# Altium schematic sheet CONNECTOR_BUS.SchDoc
size 420 x 297 mm; SheetNumber: 8; SheetTotal: 34
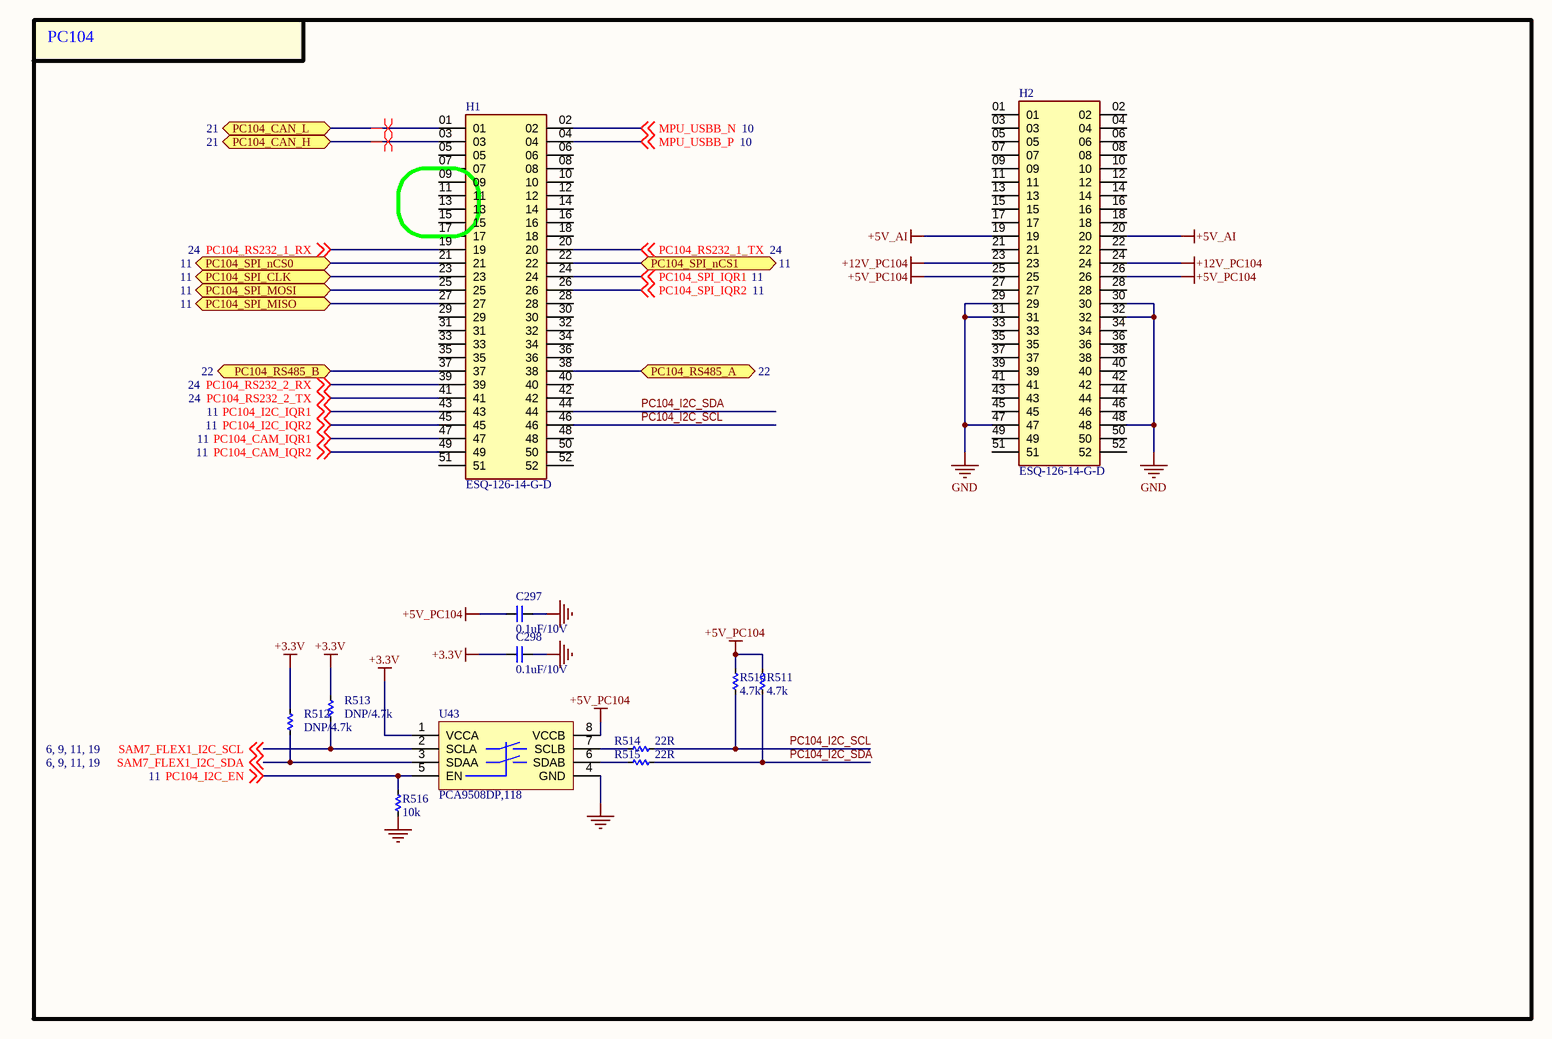
[diagram p0: CONNECTOR_BUS.SchDoc]

## Parts
C297  0.1uF/10V  [CAP_C_1005X50_L]
C298  0.1uF/10V  [CAP_C_1005X50_L]
H1  ESQ-126-14-G-D  [SAMTEC_ESQ-126-14-G-D]
H2  ESQ-126-14-G-D  [SAMTEC_ESQ-126-14-G-D]
R510  4.7k  [RES_C_1005X40]
R511  4.7k  [RES_C_1005X40]
R512  DNP/4.7k  [RES_C_1005X40]
R513  DNP/4.7k  [RES_C_1005X40]
R514  22R  [RES_C_1005X40]
R515  22R  [RES_C_1005X40]
R516  10k  [RES_C_1005X40]
U43  PCA9508DP,118  [TSOP8]

## Blocks framed on the sheet
PC104: C297 C298 H1 H2 R510-R516 U43

## Ports
PC104_CAN_H (bidir, see 21), PC104_CAN_L (bidir, see 21), PC104_RS485_A (bidir, see 22), PC104_RS485_B (bidir, see 22), PC104_SPI_CLK (bidir, see 11), PC104_SPI_MISO (bidir, see 11), PC104_SPI_MOSI (bidir, see 11), PC104_SPI_nCS0 (bidir, see 11), PC104_SPI_nCS1 (bidir, see 11)

## Nets
+3.3V: C298.2 R512.1 R513.1 U43.1(VCCA)
+5V_AI: H2.19 H2.20
+5V_PC104: C297.2 H2.25 H2.26 R510.1 R511.1 U43.8(VCCB)
+12V_PC104: H2.23 H2.24
GND: C297.1 C298.1 H2.29 H2.30 H2.31 H2.32 H2.47 H2.48 R516.2 U43.4(GND)
MPU_USBB_N: H1.02 ; off-sheet MPU_USBB_N
MPU_USBB_P: H1.04 ; off-sheet MPU_USBB_P
PC104_CAM_IQR1: H1.47 ; off-sheet PC104_CAM_IQR1
PC104_CAM_IQR2: H1.49 ; off-sheet PC104_CAM_IQR2
PC104_CAN_H: H1.03 ; port PC104_CAN_H
PC104_CAN_L: H1.01 ; port PC104_CAN_L
PC104_I2C_EN: R516.1 U43.5(EN) ; off-sheet PC104_I2C_EN
PC104_I2C_IQR1: H1.43 ; off-sheet PC104_I2C_IQR1
PC104_I2C_IQR2: H1.45 ; off-sheet PC104_I2C_IQR2
PC104_I2C_SCL: H1.46 R510.2 R514.2
PC104_I2C_SDA: H1.44 R511.2 R515.2
PC104_RS232_1_RX: H1.19 ; off-sheet PC104_RS232_1_RX
PC104_RS232_1_TX: H1.20 ; off-sheet PC104_RS232_1_TX
PC104_RS232_2_RX: H1.39 ; off-sheet PC104_RS232_2_RX
PC104_RS232_2_TX: H1.41 ; off-sheet PC104_RS232_2_TX
PC104_RS485_A: H1.38 ; port PC104_RS485_A
PC104_RS485_B: H1.37 ; port PC104_RS485_B
PC104_SPI_CLK: H1.23 ; port PC104_SPI_CLK
PC104_SPI_IQR1: H1.24 ; off-sheet PC104_SPI_IQR1
PC104_SPI_IQR2: H1.26 ; off-sheet PC104_SPI_IQR2
PC104_SPI_MISO: H1.27 ; port PC104_SPI_MISO
PC104_SPI_MOSI: H1.25 ; port PC104_SPI_MOSI
PC104_SPI_nCS0: H1.21 ; port PC104_SPI_nCS0
PC104_SPI_nCS1: H1.22 ; port PC104_SPI_nCS1
SAM7_FLEX1_I2C_SCL: R513.2 U43.2(SCLA) ; off-sheet SAM7_FLEX1_I2C_SCL
SAM7_FLEX1_I2C_SDA: R512.2 U43.3(SDAA) ; off-sheet SAM7_FLEX1_I2C_SDA
NetR514_1: R514.1 U43.7(SCLB)
NetR515_1: R515.1 U43.6(SDAB)

Not connected (* = marked no-connect by the designer): H1 05 06 07 08 09 10 11 12 13 14 15 16 17 18 28 29 30 31 32 33 34 35 36 40 42 48 50 51 52; H2 01 02 03 04 05 06 07 08 09 10 11 12 13 14 15 16 17 18 21 22 27 28 33 34 35 36 37 38 39 40 41 42 43 44 45 46 49 50 51 52

## Layout directives
differential pair; net class DIFF100; differential pair class DIFF100: PC104_CAN_H, PC104_CAN_L

## Notes on the sheet
- Project:
- Sub-system:
- Design by:
- Sheet title:
- Sheet
- of
- Checked by:
- Approved by:
- Revision:
- Document No:
- Size:
- Date:
- A3

## Library data of the parts
C297 C298 = _CAP_C_2: CAP CHIP
H1 H2 = ESQ-126-14-G-D: CONN SOCKET 52POS 0.1 GOLD PCB; MF: Samtec; MP: ESQ-126-14-G-D; Price: None; Package: None; Value: *; Availability: Unavailable
R510-R516 = _RES_B_2: RES